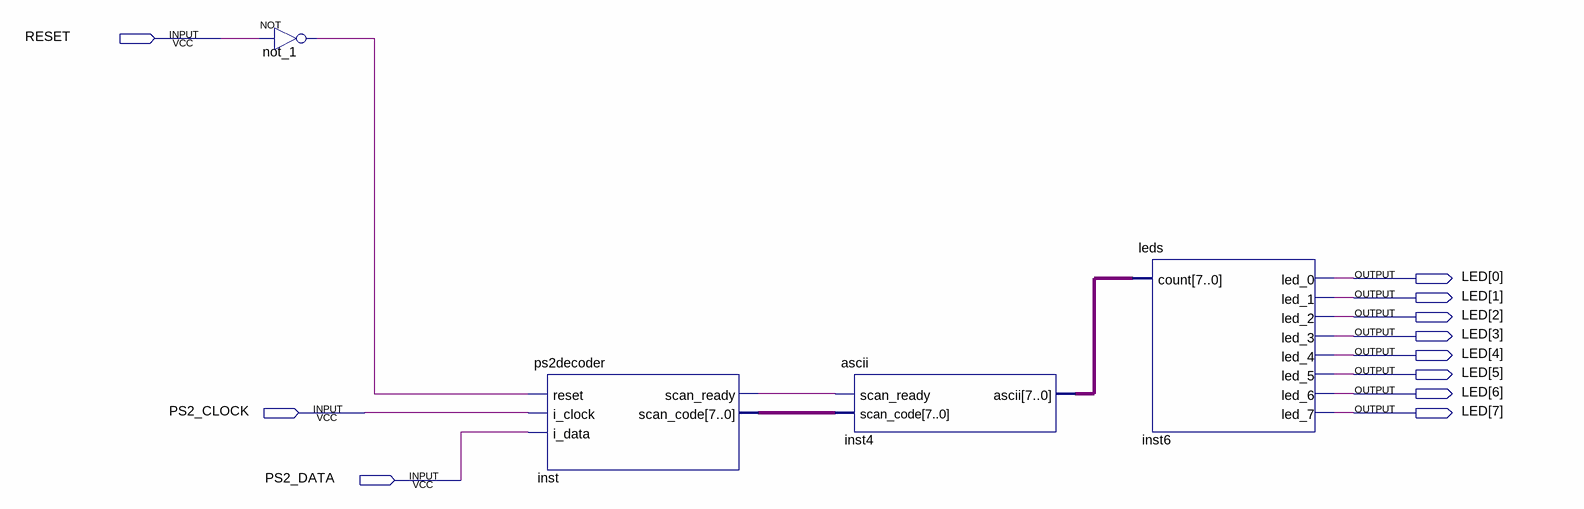
[diagram p0: schematic sheet]
// Quartus schematic keyboard.bdf as structural Verilog: 4 symbols, 11 pins
module keyboard (
  input  RESET,
  input  PS2_CLOCK,
  input  PS2_DATA,
  output [7:0] LED
);

  wire inst_scan_ready, not_1_out;
  wire [7:0] inst4_ascii, inst_scan_code;

  not not_1 (not_1_out, RESET);
  ps2decoder inst (
    .reset(not_1_out), .i_clock(PS2_CLOCK), .i_data(PS2_DATA), .scan_ready(inst_scan_ready),
    .scan_code(inst_scan_code));
  ascii inst4 (.scan_ready(inst_scan_ready), .scan_code(inst_scan_code), .ascii(inst4_ascii));
  leds inst6 (
    .count(inst4_ascii), .led_0(LED[0]), .led_1(LED[1]), .led_2(LED[2]), .led_3(LED[3]), .led_4(LED[4]),
    .led_5(LED[5]), .led_6(LED[6]), .led_7(LED[7]));
endmodule
